# EasyEDA Pro project ProPrj_底座_2025-10-22.epro

# Schematic Schematic1
Board Name: Board1; Create Date: 2025-09-16; Page Name: P1; Project Name: 底座; Schematic Name: Schematic1; Update Date: 2025-09-16; Company: 嘉立创EDA; Page Size: A4; Version: V1.0
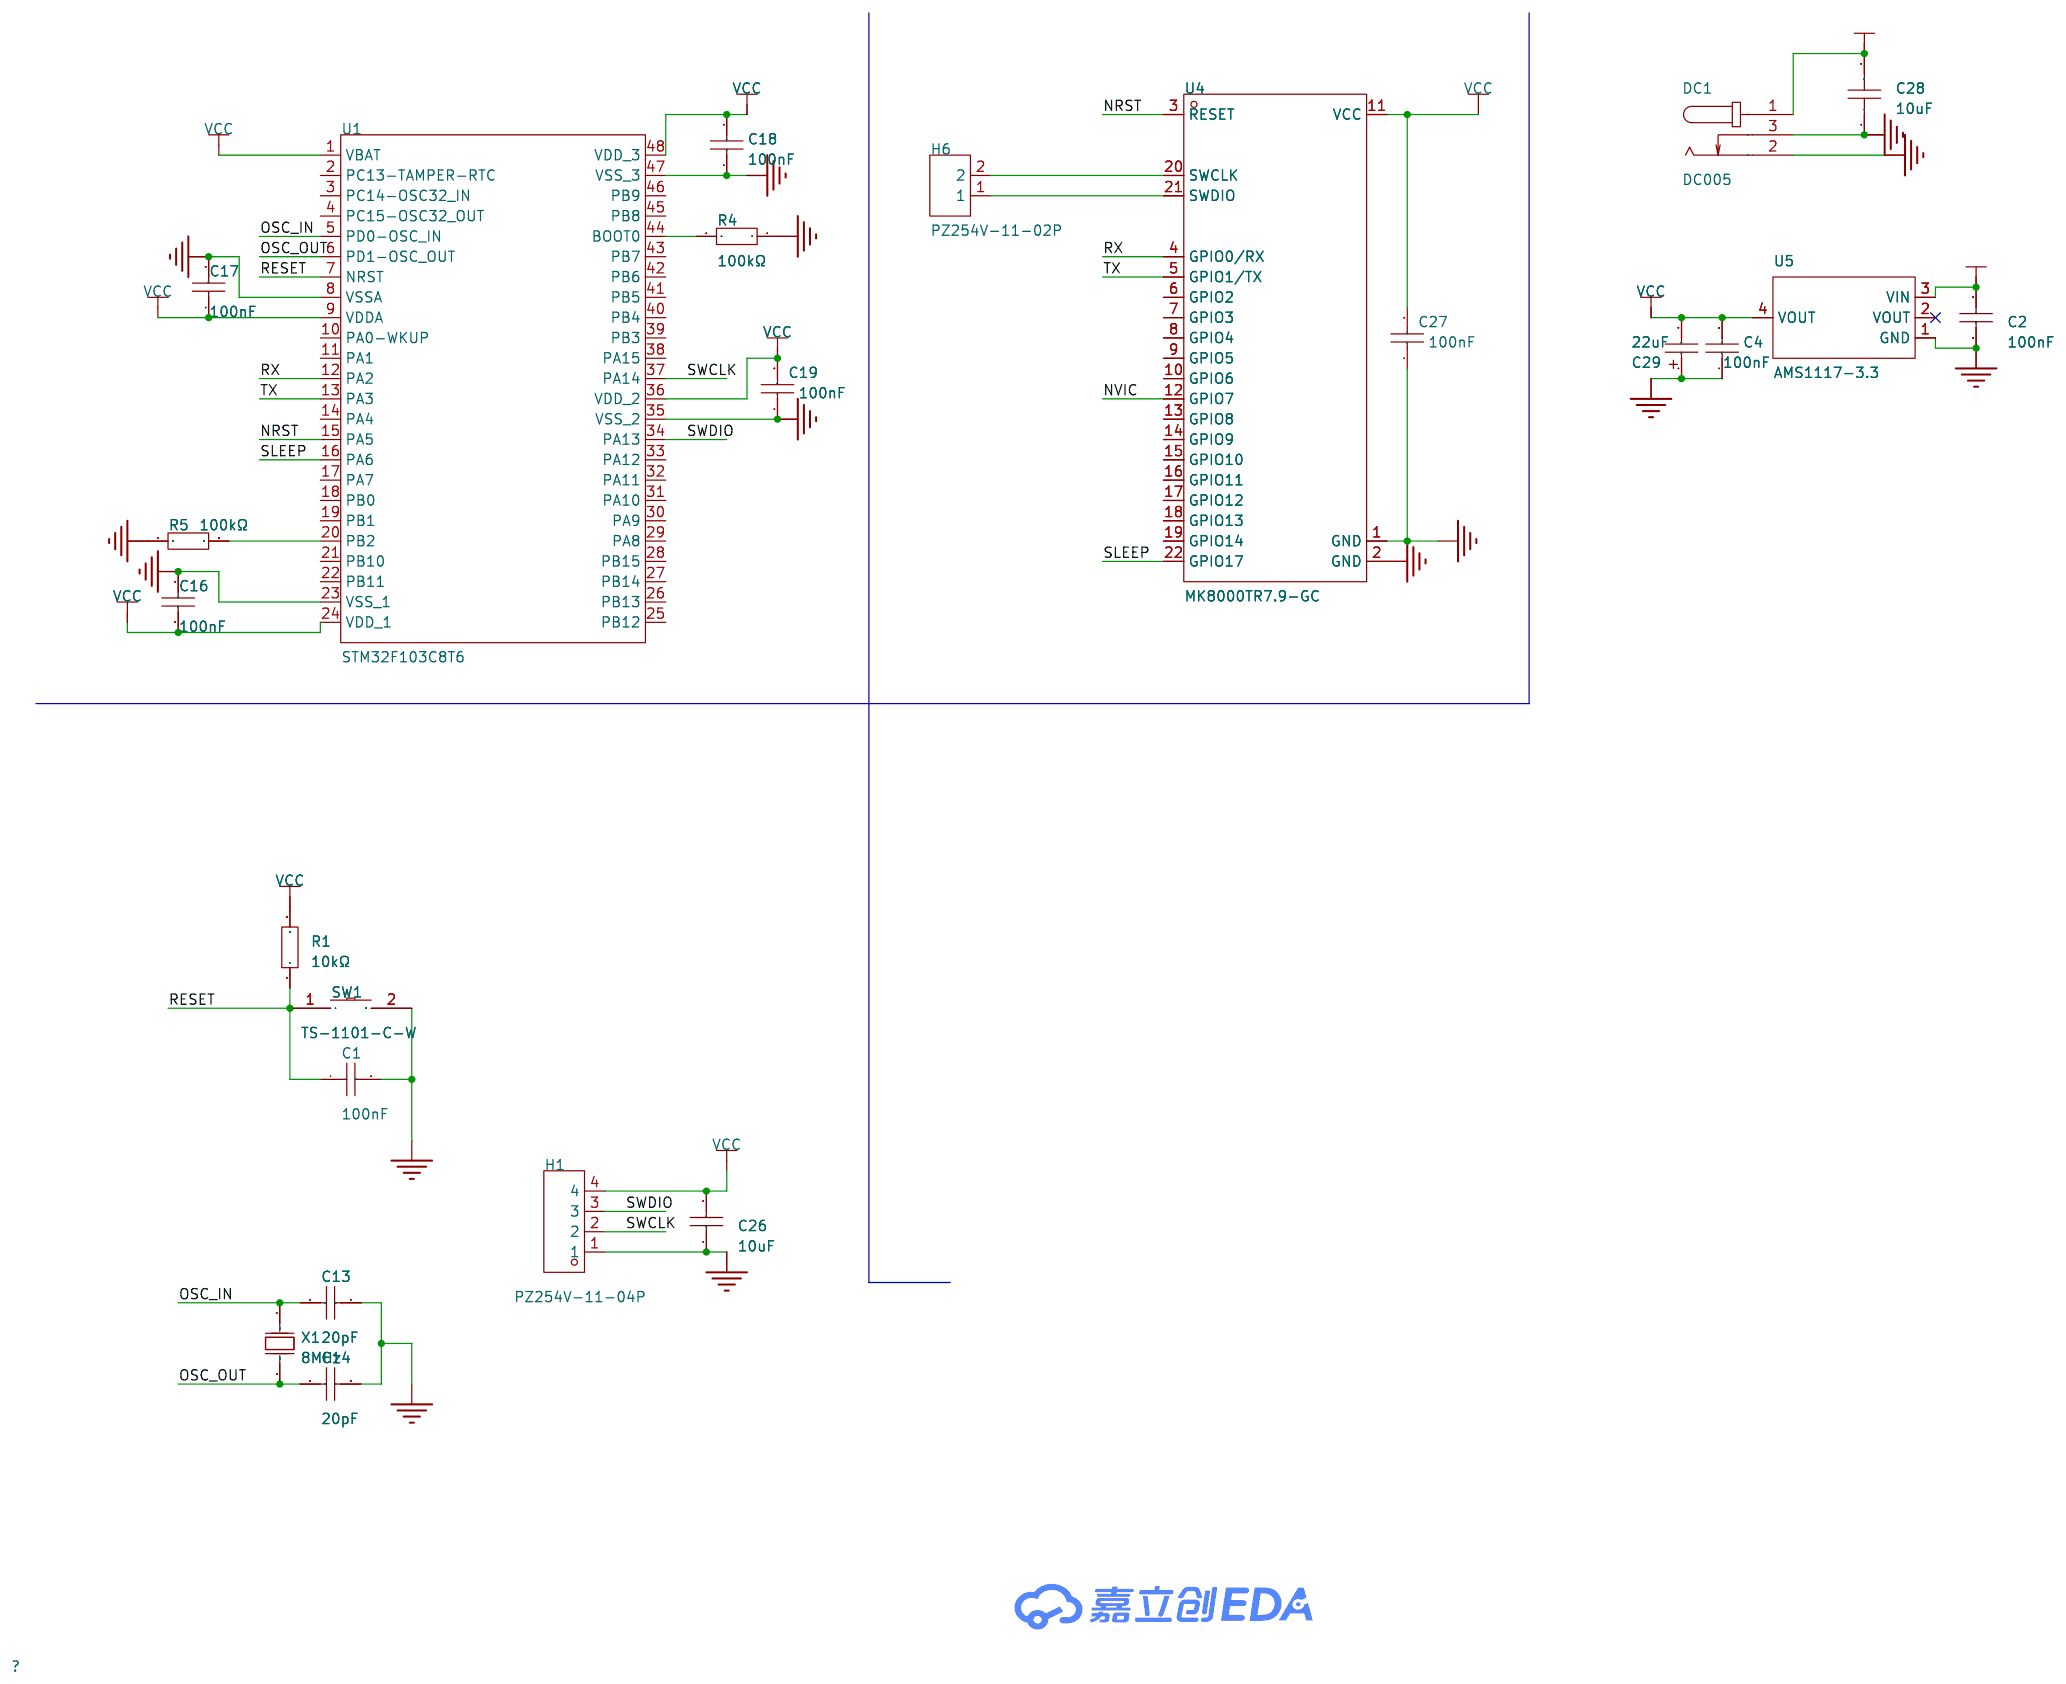
[diagram p0: schematic sheet]

## Parts
C1  100nF  [C0805]
C2  100nF  [C0805]
C4  100nF  [C0805]
C13  20pF  [C0805]
C14  20pF  [C0805]
C16  100nF  [C0805]
C17  100nF  [C0805]
C18  100nF  [C0805]
C19  100nF  [C0805]
C26  10uF  [C0805]
C27  100nF  [C0805]
C28  10uF  [C0805]
C29  22uF  [CASE-A_3216]
DC1  DC005  [DC-IN-TH_DC005]
H1  PZ254V-11-04P  [HDR-TH_4P-P2.54-V-M]
H6  PZ254V-11-02P  [HDR-TH_2P-P2.54-V-M]
R1  10kΩ  [R0805]
R4  100kΩ  [R0805]
R5  100kΩ  [R0805]
SW1  TS-1101-C-W  [SW-SMD_L6.0-W3.3-LS8.0]
U1  STM32F103C8T6  [LQFP-48_L7.0-W7.0-P0.50-LS9.0-BL]
U4  MK8000TR7.9-GC  [COMM-SMD_L26.3-W16.1_MK8000TR7.9-GC]
U5  AMS1117-3.3  [SOT-223-3_L6.5-W3.4-P2.30-LS7.0-BR]
X1  8MHz  [CRYSTAL-SMD_L11.5-W4.8-LS12.7]

## Library data of the parts
C1 C2 C4 C16-C19 C27 = CL21B104KBCNNNC: 容值:100nF;精度:±10%;额定电压:50V;材质(温度系数):X7R;; LCSC Part Name: 100nF ±10% 50V; Supplier Part: C1711; Manufacturer: SAMSUNG(三星); Supplier Footprint: 0805; JLCPCB Part Class: 扩展库; Datasheet: https://atta.szlcsc.com/upload/public/pdf/source/20160218/1457707763339.pdf; Supplier: LCSC; Tolerance: ±10%; Voltage Rated: 50V; Temperature Coefficient: X7R
C13 C14 = CL21C200JBANNNC: 容值:20pF;精度:±5%;额定电压:50V;材质(温度系数):C0G;; LCSC Part Name: 20pF ±5% 50V; Supplier Part: C1798; Manufacturer: SAMSUNG(三星); Supplier Footprint: 0805; JLCPCB Part Class: 基础库; Datasheet: https://atta.szlcsc.com/upload/public/pdf/source/20160218/1457707763339.pdf; Supplier: LCSC; Tolerance: ±5%; Voltage Rated: 50V; Temperature Coefficient: C0G
C26 = CL21A106KOQNNNE: 容值:10uF;精度:±10%;额定电压:16V;温度系数:X5R;; LCSC Part Name: 10uF ±10% 16V; Supplier Part: C1713; Manufacturer: SAMSUNG(三星); Supplier Footprint: 0805; JLCPCB Part Class: 扩展库; Datasheet: https://item.szlcsc.com/datasheet/CL21A106KOQNNNE/2065.html; Supplier: LCSC; Tolerance: ±10%; Voltage Rating: 16V; Temperature Coefficient: X5R
C28 = CL21A106KBYQNNE: 容值:10uF;精度:±10%;额定电压:50V;温度系数:X5R;; LCSC Part Name: 10uF ±10% 50V; Supplier Part: C2932476; Manufacturer: SAMSUNG(三星); Supplier Footprint: 0805; JLCPCB Part Class: 扩展库; Datasheet: https://item.szlcsc.com/datasheet/CL21A106KBYQNNE/3277789.html; Supplier: LCSC; Tolerance: ±10%; Voltage Rating: 50V; Temperature Coefficient: X5R
C29 = TAJA226K010RNJ: 容值:22uF;精度:±10%;额定电压:10V;等效串联电阻(ESR):3Ω@100kHz;; LCSC Part Name: 22uF ±10% 10V; Supplier Part: C11366; Manufacturer: Kyocera AVX; Supplier Footprint: CASE-A-3216-18(mm); JLCPCB Part Class: 扩展库; Supplier: LCSC; Tolerance: ±10%; Voltage Rating: 10V; Equivalent Series Resistance(ESR): 3Ω@100kHz; Operating Temperature: -55℃~+125℃
DC1 = DC005: 连接器类型:DC电源插座;安装方式:弯插;触点内径:2mm;触点外径:6.3mm;额定电流:500mA;额定电压:30V;工作温度:-25℃~+70℃;; LCSC Part Name: DC电源插座 内径:2mm 外径:6.3mm; Supplier Part: C431533; Manufacturer: SHOU HAN(首韩); Supplier Footprint: 插件; JLCPCB Part Class: 扩展库; Datasheet: https://item.szlcsc.com/datasheet/DC005/427890.html; Supplier: LCSC; Connector Type: DC电源插座; Mounting Type: 弯插; Inside Contact Diameter: 2mm; Outside Contact Diameter: 6.3mm; Current Rating: 500mA; Voltage Rating (Max): 30V; Operating Temperature: -25℃~+70℃
H1 = PZ254V-11-04P: 插针结构:1x4P;间距:2.54mm;行距:-;圆针/方针:方针;安装类型:直插;排数:单排;总PIN位数:4P;额定电流:3A;额定电压:250V;配合针长度:6mm;塑高:2.5mm;端接针长度:3mm;触头材质:-;工作温度范围:-40℃~+105℃;颜色:黑色;; LCSC Part Name: 间距:2.54mm 1x4P 直插 方针; Supplier Part: C2691448; Manufacturer: XFCN(兴飞); Supplier Footprint: 插件,P=2.54mm; JLCPCB Part Class: 扩展库; Datasheet: https://atta.szlcsc.com/upload/public/pdf/source/20200309/C492403_F9F19131791D08044AD4F84F8E751A34.pdf; Supplier: LCSC; Pin Structure: 1x4P; Pitch: 2.54mm; Circluar Pins/Square Pins: 方针; Mounting Type: 直插; Number of Rows: 单排; Number of Pins: 4P; Current Rating (Max): 3A; Voltage Rating (Max): 250V; Length of Mating Pin: 6mm; Insulation Height: 2.5mm; Length of End Connection Pin: 3mm; Operating Temperature Range: -40℃~+105℃; Color: 黑色
H6 = PZ254V-11-02P: 插针结构:1x2P;间距:2.54mm;行距:-;圆针/方针:方针;安装方式:直插;排数:单排;总PIN位数:2P;额定电流:-;额定电压:-;配合针长度:6mm;塑高:2.5mm;端接针长度:3mm;触头材质:黄铜;触头镀层:-;工作温度:-40℃~+105℃;颜色:黑色;; LCSC Part Name: 1x2P 间距:2.54mm 方针 直插; Supplier Part: C492401; Manufacturer: XFCN(兴飞); Supplier Footprint: 插件,P=2.54mm; JLCPCB Part Class: 扩展库; Datasheet: https://item.szlcsc.com/datasheet/PZ254V-11-02P/502957.html; Supplier: LCSC; Pin Structure: 1x2P; Pitch: 2.54mm; Circluar Pins/Square Pins: 方针; Mounting Type: 直插; Number of Rows: 单排; Number of Pins: 2P; Length of Mating Pin: 6mm; Insulation Height: 2.5mm; Length of End Connection Pin: 3mm; Contact Material: 黄铜; Operating Temperature: -40℃~+105℃; Color: 黑色
R1 = 0805W8F1002T5E_C17414: 电阻类型:厚膜电阻;阻值:10kΩ;精度:±1%;功率:125mW;工作电压:150V;温度系数:±100ppm/℃;; LCSC Part Name: 10kΩ ±1% 125mW 厚膜电阻; Supplier Part: C17414; Manufacturer: UNI-ROYAL(厚声); Manufacturer Part: 0805W8F1002T5E; Supplier Footprint: 0805; JLCPCB Part Class: 基础库; Datasheet: https://atta.szlcsc.com/upload/public/pdf/source/20200306/C422600_1E6D84923E4A46A82E41ADD87F860B5C.pdf; Supplier: LCSC; Type: 厚膜电阻; Tolerance: ±1%; Power(Watts): 125mW; Voltage-Supply(Max): 150V; Temperature Coefficient: ±100ppm/℃; Operating Temperature: -55℃~+155℃
R4 R5 = 0805W8F1003T5E: 电阻类型:厚膜电阻;阻值:100kΩ;精度:±1%;功率:125mW;工作电压:150V;温度系数:±100ppm/℃;; LCSC Part Name: 100kΩ ±1% 125mW 厚膜电阻; Supplier Part: C149504; Manufacturer: UNI-ROYAL(厚声); Supplier Footprint: 0805; JLCPCB Part Class: 基础库; Datasheet: https://atta.szlcsc.com/upload/public/pdf/source/20200306/C422600_1E6D84923E4A46A82E41ADD87F860B5C.pdf; Supplier: LCSC; Type: 厚膜电阻; Tolerance: ±1%; Power(Watts): 125mW; Voltage-Supply(Max): 150V; Temperature Coefficient: ±100ppm/℃; Operating Temperature: -55℃~+155℃
SW1 = TS-1101-C-W: 电路结构:单刀单掷;按钮形状:矩形按钮;作用力:260gf;安装方式:立贴;开关长度:6mm;开关宽度:3.6mm;开关高度:2.5mm;带支架:不带;触点电流:50mA;额定电压(AC):-;额定电压(DC):12V;额定功率:-;绝缘电阻:-;带灯:无;机械寿命:5万次;; LCSC Part Name: 6*3.6*2.5mm 立贴 轻触开关; Supplier Part: C318938; Manufacturer: XKB Connectivity(中国星坤); Supplier Footprint: SMD; JLCPCB Part Class: 扩展库; Datasheet: https://atta.szlcsc.com/upload/public/pdf/source/20200227/C318938_C2E53B1EEDE37D980A33616AC086DE53.pdf; Supplier: LCSC; Circuit: 单刀单掷; Actuator Style: 矩形按钮; Operating Force: 260gf; Mounting Style: 立贴; Switch Length: 6mm; Switch Width: 3.6mm; Switch Height: 2.5mm; Strike Gundam: 不带; Contact Current: 50mA; Voltage Rating (DC): 12V; Actuator/Cap Color: 白色带淡绿; With Lamp: 无; Mechanical Life: 5万次; Operating Temperature: -30℃~+85℃
U1 = STM32F103C8T6: CPU内核:ARM-M3;CPU最大主频:72MHz;应用领域:-;; LCSC Part Name: 主流增强型ARM Cortex-M3 MCU，具有64 KB Flash、72 MHz CPU、电机控制、USB和CAN; Supplier Part: C8734; Manufacturer: ST(意法半导体); Supplier Footprint: LQFP-48(7x7); JLCPCB Part Class: 扩展库; Datasheet: https://item.szlcsc.com/datasheet/STM32F103C8T6/9243.html; Supplier: LCSC; CPU Core: ARM-M3; CPU Maximum Speed: 72MHz; Program Storage Size: 64KB; Program Memory Type: FLASH; Number of I/O: 37; ADC (Bit): 12bit; Voltage - Supply: 2V~3.6V
U4 = MK8000TR7.9-GC: 国产UWB测距模块电子围栏应用; Supplier Part: C42382001; Manufacturer: Silicontra(硅传科技); Supplier Footprint: SMD,26.3x15.1mm; JLCPCB Part Class: Extended Part; Datasheet: https://atta.szlcsc.com/upload/public/pdf/source/20241115/1BBDFCDE45D079C44B86411E68911EA9.pdf; Supplier: LCSC
U5 = AMS1117-3.3_C6186: 输出类型:固定;工作电压:16V;输出电压:3.3V;输出电流:1A;电源纹波抑制比(PSRR):72dB@(120Hz);输出极性:正极;; LCSC Part Name: 输出3.3V 1A; Supplier Part: C6186; Manufacturer: AMS; Supplier Footprint: SOT-223; JLCPCB Part Class: 基础库; Datasheet: https://item.szlcsc.com/datasheet/AMS1117-3.3/6652.html; Supplier: LCSC; Output Type: 固定; Voltage - Supply: 16V; Output Voltage: 3.3V; Output Current: 1A; Power Supply Rejection Ratio (PSRR): 72dB@(120Hz); Voltage Dropout: 1.1V@(800mA); standby current: 5mA; Features: 过流保护；过热保护; Operating Temperature: -40℃~+125℃; Output Configuration: 正极; Number of Outputs: 1
X1 = X49SM8MSD2SC: 晶振类型:贴片晶振;频率:8MHz;常温频差:±20ppm;负载电容:20pF;频率稳定度:±30ppm;; LCSC Part Name: HC-49SMD 8MHZ 2P 49SMD 20PF ±20PPM -20~70℃（±30PPM）; Supplier Part: C12674; Manufacturer: YXC(扬兴晶振); Supplier Footprint: HC-49S-SMD; JLCPCB Part Class: 基础库; Datasheet: https://item.szlcsc.com/datasheet/X49SM8MSD2SC/13310.html; Supplier: LCSC; Type: 贴片晶振; Normal temperature Frequency Tolerance: ±20ppm; Load Capacitance: 20pF; Frequency Stability: ±30ppm; Operating Temperature: -20℃~+70℃

## Nets
+12V: C2.2 C28.2 DC1.1 U5.3(VIN)
GND: C1.2 C2.1 C4.1 C13.1 C14.1 C16.1 C17.2 C18.1 C19.1 C26.1 C27.1 C28.1 C29.1 DC1.2 DC1.3 H1.1 R4.1 R5.1 SW1.2 U1.8(VSSA) U1.23(VSS_1) U1.35(VSS_2) U1.47(VSS_3) U4.1(GND) U4.2(GND) U5.1(GND)
VCC: C4.2 C16.2 C17.1 C18.2 C19.2 C26.2 C27.2 C29.2 H1.4 R1.2 U1.1(VBAT) U1.9(VDDA) U1.24(VDD_1) U1.36(VDD_2) U1.48(VDD_3) U4.11(VCC) U5.4(VOUT)
NRST: U1.15(PA5) U4.3(RESET)
NVIC: U4.12(GPIO7)
OSC_IN: C13.2 U1.5(PD0-OSC_IN) X1.1(OSC1)
OSC_OUT: C14.2 U1.6(PD1-OSC_OUT) X1.2(OSC2)
RESET: C1.1 R1.1 SW1.1 U1.7(NRST)
RX: U1.12(PA2) U4.4(GPIO0/RX)
SLEEP: U1.16(PA6) U4.22(GPIO17)
SWCLK: H1.2 U1.37(PA14)
SWDIO: H1.3 U1.34(PA13)
TX: U1.13(PA3) U4.5(GPIO1/TX)
$1N615: R5.2 U1.20(PB2)
$1N621: R4.2 U1.44(BOOT0)
$1N1246: H6.2 U4.20(SWCLK)
$1N1247: H6.1 U4.21(SWDIO)

Not connected (* = marked no-connect by the designer): U1 2(PC13-TAMPER-RTC) 3(PC14-OSC32_IN) 4(PC15-OSC32_OUT) 10(PA0-WKUP) 11(PA1) 14(PA4) 17(PA7) 18(PB0) 19(PB1) 21(PB10) 22(PB11) 25(PB12) 26(PB13) 27(PB14) 28(PB15) 29(PA8) 30(PA9) 31(PA10) 32(PA11) 33(PA12) 38(PA15) 39(PB3) 40(PB4) 41(PB5) 42(PB6) 43(PB7) 45(PB8) 46(PB9); U4 6(GPIO2) 7(GPIO3) 8(GPIO4) 9(GPIO5) 10(GPIO6) 13(GPIO8) 14(GPIO9) 15(GPIO10) 16(GPIO11) 17(GPIO12) 18(GPIO13) 19(GPIO14); U5 2(VOUT)*

# Board PCB1
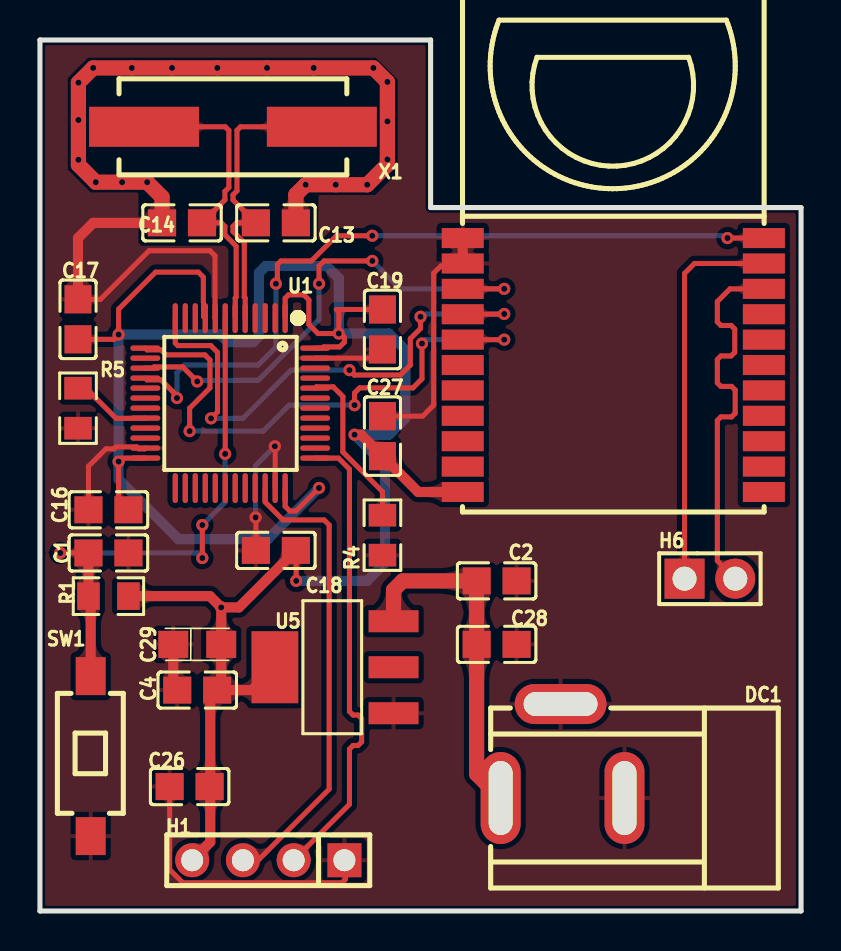
[diagram p1: board, top side]
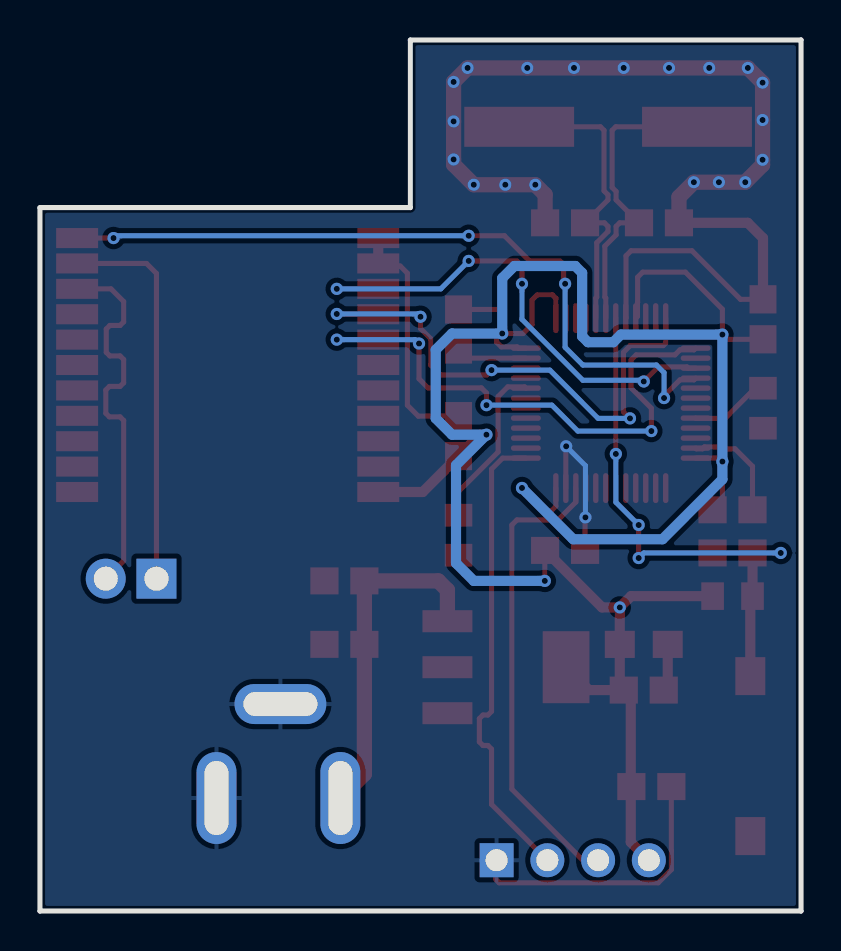
[diagram p2: board, bottom side, seen from below]

Outline 38.1 x 43.56 mm; copper layers: Top Layer, Bottom Layer. Coordinates in mm from the lower left corner of the outline.
Outline path: 0,43.56 0,0 38.1,0 38.1,35.18 19.56,35.18 19.56,43.56 0,43.56
Stack: Top Layer 0.035mm / Dielectric1 1.51mm FR4 er 4.5 / Bottom Layer 0.035mm

## Design rules (mm)
net OSC_IN: DP1
net OSC_OUT: DP1
net SWCLK: DP2
net SWDIO: DP2
template: JLCPCB Capability(Two Layers Board)
spacing copperThickness1oz (default): track to track 0.102, other pairs 0.152 to 0.3
spacing copperThickness2oz: track to track 0.203, other pairs 0.152 to 0.3
track width copperThickness1oz (default): min 0.127, default 0.254, max 2.54
track width copperThickness2oz: min 0.203, default 0.254, max 2.54
differential pair differentialPair (default): width min 0.127, default 0.254, max 2.54; gap min 0.152, default 0.152
via viaSize (default): diameter min 0.5, default 0.61, max 10; hole min 0.3, default 0.305, max 6.3

## Placement (name value [footprint] x y rotation side)
C1  100nF  [C0805]  3.43 17.91 0 top
C2  100nF  [C0805]  22.86 16.51 180 top
C4  100nF  [C0805]  7.87 11.05 0 top
C13  20pF  [C0805]  11.81 34.42 180 top
C14  20pF  [C0805]  7.11 34.42 0 top
C16  100nF  [C0805]  3.43 20.07 0 top
C17  100nF  [C0805]  1.91 29.59 90 top
C18  100nF  [C0805]  11.81 18.03 0 top
C19  100nF  [C0805]  17.14 29.08 90 top
C26  10uF  [C0805]  7.49 6.22 0 top
C27  100nF  [C0805]  17.14 23.75 270 top
C28  10uF  [C0805]  22.86 13.34 180 top
C29  22uF  [CASE-A_3216]  7.87 13.34 0 top
DC1  DC005  [DC-IN-TH_DC005]  26.16 8 180 top
H1  PZ254V-11-04P  [HDR-TH_4P-P2.54-V-M]  11.43 2.54 180 top
H6  PZ254V-11-02P  [HDR-TH_2P-P2.54-V-M]  33.54 16.62 0 top
R1  10kΩ  [R0805]  3.43 15.75 0 top
R4  100kΩ  [R0805]  17.14 18.8 90 top
R5  100kΩ  [R0805]  1.91 25.15 90 top
SW1  TS-1101-C-W  [SW-SMD_L6.0-W3.3-LS8.0]  2.54 7.75 270 top
U1  STM32F103C8T6  [LQFP-48_L7.0-W7.0-P0.50-LS9.0-BL]  9.52 25.4 180 top
U4  MK8000TR7.9-GC  [COMM-SMD_L26.3-W16.1_MK8000TR7.9-GC]  28.7 27.31 0 top
U5  AMS1117-3.3  [SOT-223-3_L6.5-W3.4-P2.30-LS7.0-BR]  14.73 12.19 0 top
X1  8MHz  [CRYSTAL-SMD_L11.5-W4.8-LS12.7]  9.66 39.22 180 top

## Footprints (pads in the part's own frame, mm; a bottom-side part is the same pattern mirrored in y, then rotated)
C0805
  rect 1.41x1.35 smd: 1(-1,0) 2(1,0)
CASE-A_3216
  rect 1.5x1.359 smd: 1(-1.2,0) 2(1.2,0)
COMM-SMD_L26.3-W16.1_MK8000TR7.9-GC
  rect 2.102x1.002 smd: 1(-7.537,6.35) 2(-7.537,5.08) 3(-7.537,3.81) 4(-7.537,2.54) 5(-7.537,1.27) 6(-7.537,0) 7(-7.537,-1.27) 8(-7.537,-2.54) 9(-7.537,-3.81) 10(-7.537,-5.08) 11(-7.537,-6.35) 12(7.537,-6.35) 13(7.537,-5.08) 14(7.537,-3.81) 15(7.537,-2.54) 16(7.537,-1.27) 17(7.537,0) 18(7.537,1.27) 19(7.537,2.54) 20(7.537,3.81) 21(7.537,5.08) 22(7.537,6.35)
CRYSTAL-SMD_L11.5-W4.8-LS12.7
  rect 5.5x2 smd: 1(-4.45,0) 2(4.45,0)
DC-IN-TH_DC005
  oval 2x4.6 hole 1.2x3.7: 1(3.1,2.35) 2(-3.1,2.35)
  oval 4.6x2 hole 3.7x1.2: 3(0.1,-2.35)
HDR-TH_2P-P2.54-V-M
  rect 2x2 hole 1.2: 1(-1.27,0)
  round 2 hole 1.2: 2(1.27,0)
HDR-TH_4P-P2.54-V-M
  rect 1.7x1.7 hole 1.1: 1(-3.81,0)
  round 1.7 hole 1.1: 2(-1.27,0) 3(1.27,0) 4(3.81,0)
LQFP-48_L7.0-W7.0-P0.50-LS9.0-BL
  oval 0.27x1.5 smd: 1(-2.75,-4.25) 2(-2.25,-4.25) 3(-1.75,-4.25) 4(-1.25,-4.25) 5(-0.75,-4.25) 6(-0.25,-4.25) 7(0.25,-4.25) 8(0.75,-4.25) 9(1.25,-4.25) 10(1.75,-4.25) 11(2.25,-4.25) 12(2.75,-4.25) 25(2.75,4.25) 26(2.25,4.25) 27(1.75,4.25) 28(1.25,4.25) 29(0.75,4.25) 30(0.25,4.25) 31(-0.25,4.25) 32(-0.75,4.25) 33(-1.25,4.25) 34(-1.75,4.25) 35(-2.25,4.25) 36(-2.75,4.25)
  oval 1.5x0.27 smd: 13(4.25,-2.75) 14(4.25,-2.25) 15(4.25,-1.75) 16(4.25,-1.25) 17(4.25,-0.75) 18(4.25,-0.25) 19(4.25,0.25) 20(4.25,0.75) 21(4.25,1.25) 22(4.25,1.75) 23(4.25,2.25) 24(4.25,2.75) 37(-4.25,2.75) 38(-4.25,2.25) 39(-4.25,1.75) 40(-4.25,1.25) 41(-4.25,0.75) 42(-4.25,0.25) 43(-4.25,-0.25) 44(-4.25,-0.75) 45(-4.25,-1.25) 46(-4.25,-1.75) 47(-4.25,-2.25) 48(-4.25,-2.75)
R0805
  rect 1.133x1.377 smd: 1(-1,0) 2(1,0)
SOT-223-3_L6.5-W3.4-P2.30-LS7.0-BR
  rect 2.5x1.1 smd: 1(2.97,-2.3) 2(2.97,0) 3(2.97,2.3)
  rect 2.34x3.6 smd: 4(-2.97,0)
SW-SMD_L6.0-W3.3-LS8.0
  rect 1.9x1.5 smd: 1(-4,0) 2(4,0)

## Nets
As in the schematic.

Pads without a net: U1 2 3 4 10 11 14 17 18 19 21 22 25 26 27 28 29 30 31 32 33 38 39 40 41 42 43 45 46; U4 6 7 8 9 10 13 14 15 16 17 18 19; U5 2

## Via types
v1: diameter 0.61, hole 0.305, Top Layer to Bottom Layer, 48 vias

## Routing (per net, layer and track width the routed paths; a pad name or vN(x,y) marks a point on that pad's centre or on a via; arc(x,y) is an arc through that point)
+12V: length 17.3
  Top Layer w0.762: DC1.1 21.86,6.85 C28.2 C2.2 18.16,16.51 17.7,16.05 U5.3
GND: length 101.4
  Top Layer w0.254: C19.1 16.71,27.65 U1.47 ; C16.1 2.43,22.24 3.3,23.11 3.7,23.11 3.8,23.21 4.84,23.21 4.94,23.11 5.24,23.11 U1.23 ; C26.1 6.49,3.01 6.49,3.01 6.49,2.07 7.15,1.41 15.11,1.41 15.29,1.59 15.29,2.49 H1.1 ; C27.1 19.16,24.75 19.71,25.3 19.71,31.9 20.07,32.26 21.04,32.26 U4.2 ; v1(11.76,23.24) 11.77,23.22 U1.35 ; v1(10.79,19.69) 10.81,19.67 C18.1 ; C17.2 3.03,30.59 5.46,33.02 8.51,33.02 8.76,32.77 8.76,29.66 U1.8
  Top Layer w0.508: 6.67,13.34 6.67,11.25 C4.1 ; C14.1 2.67,34.42 1.91,33.66 C17.2 ; U4.2 U4.1
  Top Layer w0.762: C14.1 6.11,35.7 v1(5.37,36.45) v1(4.11,36.45) v1(2.79,36.45) 1.93,37.32 v1(1.93,37.57) v1(1.93,39.56) v1(1.93,41.43) v1(2.66,42.16) v1(4.6,42.16) v1(6.61,42.16) v1(8.88,42.16) v1(11.37,42.16) v1(13.71,42.16) v1(16.69,42.16) v1(17.39,41.46) v1(17.39,39.49) v1(17.39,37.59) 17.39,37.33 v1(16.38,36.32) v1(14.81,36.32) v1(13.3,36.32) 12.81,35.83 C13.1
  Bottom Layer w0.254: v1(10.79,19.69) 10.79,22.28 v1(11.76,23.24)
VCC: length 122.4
  Top Layer w0.254: C16.2 3.94,20.56 v1(3.94,22.48) 4.11,22.65 U1.24 ; U1.9 8.19,29.74 8.19,30.44 8.18,30.44 8.18,31.7 7.93,31.95 5.79,31.95 3.94,30.1 v1(3.94,28.83) 3.7,28.59 C17.1 ; C19.2 14.84,30.08 14.96,29.97 v1(14.96,28.88) ; U1.48 14.15,28.15 14.21,28.21 15,28.21 15.24,28.45 15.24,28.7 15.06,28.88 v1(14.96,28.88) ; v1(12.83,16.51) 12.83,18.02 C18.2 ; v1(14.96,28.88) 13.92,28.88 13.46,29.34 13.46,30.56 13.21,30.82 12.45,30.82 12.27,30.65 U1.1 ; v1(13.97,21.16) 12.81,20 12.51,20 12.27,20.24 U1.36
  Top Layer w0.508: C18.2 9.96,15.18 v1(9.07,15.18) ; C4.2 8.52,10.7 8.52,3.45 H1.4 ; C4.2 10.62,11.05 U5.4 ; C4.2 9.07,11.25 C29.2 v1(9.07,15.18) ; v1(15.75,23.82) 16.07,23.82 C27.2 18.94,20.96 U4.11 ; v1(9.07,15.18) 8.51,15.75 R1.2
  Bottom Layer w0.508: v1(12.83,16.51) 16.38,16.51 17.27,17.4 17.27,22.3 v1(15.75,23.82) 17.47,23.82 18.29,24.64 18.29,28.07 17.47,28.88 v1(14.96,28.88) 14.96,31.65 14.35,32.26 11.3,32.26 10.96,31.91 10.96,28.74 10.67,28.45 9.4,28.45 9.02,28.83 v1(3.94,28.83) v1(3.94,22.48) 3.94,21.59 6.93,18.59 11.41,18.59 v1(13.97,21.16)
NRST: length 25
  Top Layer w0.254: v1(16.64,32.51) 14.22,32.51 13.97,32.26 v1(13.97,31.37) ; v1(7.87,26.48) 7.14,27.21 5.71,27.21 5.65,27.15 U1.15 ; U4.3 v1(23.24,31.12)
  Bottom Layer w0.254: v1(16.64,32.51) 18.03,31.12 v1(23.24,31.12) ; v1(13.97,31.37) 13.97,29.59 10.92,26.54 7.93,26.54 v1(7.87,26.48)
OSC_IN: length 15.6
  Top Layer w0.254: X1.1 10.04,39.22 9.86,39.04 9.86,36.02 9.66,35.82 9.66,35.56 C13.2 9.84,34.42 9.66,34.24 9.66,33.98 10.23,33.42 10.23,30.7 10.27,30.65 U1.5
OSC_OUT: length 15.6
  Top Layer w0.254: U1.6 9.77,30.65 9.82,30.7 9.82,33.25 9.26,33.82 9.26,34.24 9.08,34.42 C14.2 9.26,35.56 9.26,35.99 9.46,36.18 9.46,39.04 9.28,39.22 5.21,39.22
RESET: length 27.3
  Top Layer w0.254: C1.1 v1(1.02,17.91) ; v1(9.27,22.86) 9.27,22.86 U1.7 ; v1(8.13,17.65) v1(8.13,19.3)
  Top Layer w0.508: C1.1 R1.1 2.54,15.64 SW1.1
  Bottom Layer w0.254: v1(8.13,19.3) 9.27,20.45 v1(9.27,22.86) ; v1(1.02,17.91) 7.87,17.91 v1(8.13,17.65)
RX: length 27.2
  Top Layer w0.254: v1(15.49,27.05) 15.74,26.81 18.04,26.81 18.54,27.3 18.54,28.62 19.05,29.13 v1(19.05,29.72) ; v1(8.56,24.64) 8.89,24.96 8.89,27.94 8.55,28.28 6.9,28.28 6.77,28.4 U1.12 ; U4.4 23.23,29.85 v1(23.24,29.86)
  Bottom Layer w0.254: v1(8.56,24.64) 10.16,24.64 12.57,27.05 v1(15.49,27.05) ; v1(19.05,29.72) 19.19,29.86 v1(23.24,29.86)
SLEEP: length 38
  Top Layer w0.254: U1.16 5.36,26.56 6.06,26.56 6.86,25.77 v1(6.86,25.65) ; v1(11.81,31.37) 11.89,31.44 11.89,32.33 12.06,32.51 13.59,32.51 14.85,33.77 v1(16.64,33.77) ; U4.22 v1(34.42,33.66)
  Bottom Layer w0.254: v1(16.64,33.77) 34.3,33.77 v1(34.42,33.66) ; v1(11.81,31.37) 11.81,28.19 10.92,27.31 7.24,27.31 6.86,26.92 v1(6.86,25.65)
SWCLK: length 23.5
  Top Layer w0.254: U1.37 14.94,22.65 15.49,22.1 15.49,9.98 15.67,9.8 15.92,9.8 16.1,9.62 16.1,8.46 15.92,8.28 15.67,8.28 15.49,8.1 15.49,5.33 H1.2
SWDIO: length 23.4
  Top Layer w0.254: 10.16,2.54 10.92,2.54 14.48,6.1 14.48,19.3 14.22,19.56 12.17,19.56 11.27,20.45 U1.34
TX: length 28.6
  Top Layer w0.254: v1(7.49,24) 7.49,25.15 8.51,26.16 8.51,27.56 8.25,27.81 6.31,27.81 6.06,28.06 5.36,28.06 U1.13 ; U4.5 v1(23.24,28.58) ; v1(19.12,28.38) 19.12,26.62 18.67,26.16 16,26.16 15.75,25.91 v1(15.75,25.3)
  Bottom Layer w0.254: v1(23.24,28.58) 19.32,28.58 v1(19.12,28.38) ; v1(7.49,24) 11.18,24 12.47,25.3 v1(15.75,25.3)
$1N615: length 4
  Top Layer w0.254: R5.2 2.3,26.15 3.81,24.64 5.26,24.64 U1.20
$1N621: length 8.4
  Top Layer w0.254: R4.2 17.14,20.97 15.16,22.96 15.16,25.73 14.68,26.21 13.84,26.21 U1.44
$1N1246: length 19.5
  Top Layer w0.254: H6.2 33.91,17.52 33.91,24.53 34.09,24.71 34.62,24.71 34.8,24.89 34.8,26.06 34.62,26.24 34.09,26.24 33.91,26.42 33.91,27.58 34.09,27.76 34.6,27.76 34.78,27.94 34.78,29.11 34.6,29.28 34.09,29.28 33.91,29.46 33.91,30.48 34.54,31.12 U4.20
$1N1247: length 19.4
  Top Layer w0.254: U4.21 32.77,32.39 32.27,31.89 H6.1

## Copper pours and planes (outline as drawn; the poured copper is in the pictures)
GND on Top Layer: -4.19,48.64 42.42,48.64 42.42,-5.72 -4.19,-5.72
GND on Bottom Layer: -6.99,49.78 40,49.78 40,-2.03 -6.99,-2.03

Small or netless copper shapes (teardrops, artwork), in the pictures only: 107 on Top Layer, 30 on Bottom Layer
